# EAGLE design Multiplexer Breakout (EAGLE 9.2.2)
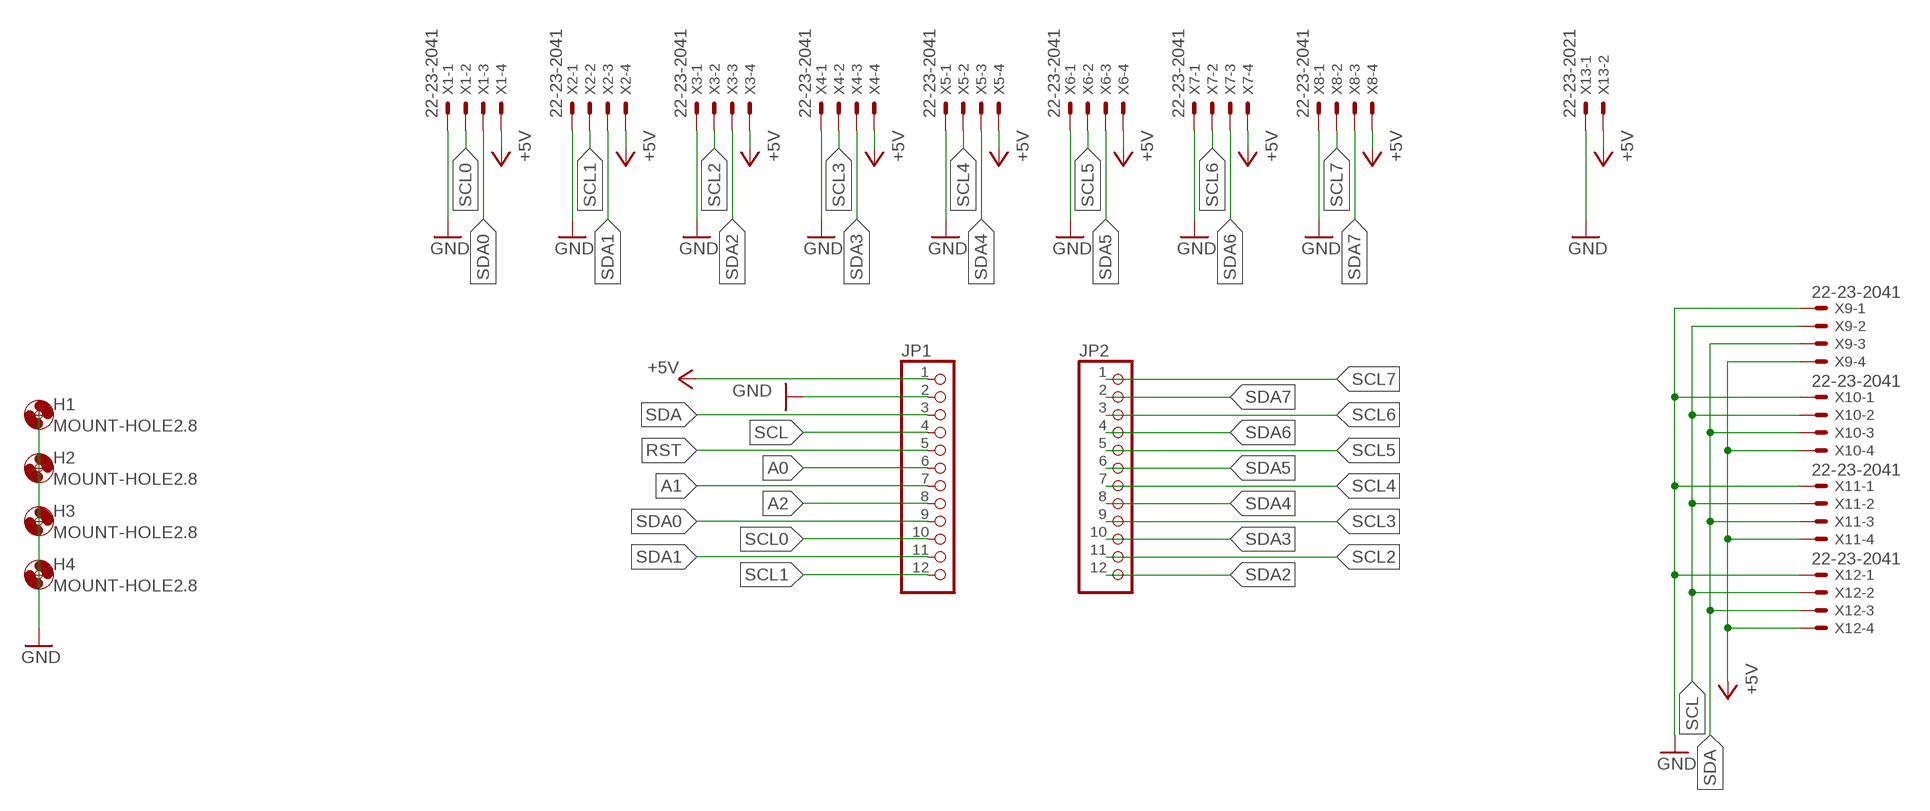
[diagram p0: schematic, sheet 1]

## Parts
H1  MOUNT-HOLE2.8  [2,8]
H2  MOUNT-HOLE2.8  [2,8]
H3  MOUNT-HOLE2.8  [2,8]
H4  MOUNT-HOLE2.8  [2,8]
JP1  PINHD-1X12  [1X12]
JP2  PINHD-1X12  [1X12]
X1  22-23-2041  [22-23-2041]
X2  22-23-2041  [22-23-2041]
X3  22-23-2041  [22-23-2041]
X4  22-23-2041  [22-23-2041]
X5  22-23-2041  [22-23-2041]
X6  22-23-2041  [22-23-2041]
X7  22-23-2041  [22-23-2041]
X8  22-23-2041  [22-23-2041]
X9  22-23-2041  [22-23-2041]
X10  22-23-2041  [22-23-2041]
X11  22-23-2041  [22-23-2041]
X12  22-23-2041  [22-23-2041]
X13  22-23-2021  [22-23-2021]

## Nets
+5V: JP1.1 X1.4 X2.4 X3.4 X4.4 X5.4 X6.4 X7.4 X8.4 X9.4 X10.4 X11.4 X12.4 X13.2
A0: JP1.6
A1: JP1.7
A2: JP1.8
GND: JP1.2 X1.1 X2.1 X3.1 X4.1 X5.1 X6.1 X7.1 X8.1 X9.1 X10.1 X11.1 X12.1 X13.1
RST: JP1.5
SCL: JP1.4 X9.2 X10.2 X11.2 X12.2
SCL0: JP1.10 X1.2
SCL1: JP1.12 X2.2
SCL2: JP2.11 X3.2
SCL3: JP2.9 X4.2
SCL4: JP2.7 X5.2
SCL5: JP2.5 X6.2
SCL6: JP2.3 X7.2
SCL7: JP2.1 X8.2
SDA: JP1.3 X9.3 X10.3 X11.3 X12.3
SDA0: JP1.9 X1.3
SDA1: JP1.11 X2.3
SDA2: JP2.12 X3.3
SDA3: JP2.10 X4.3
SDA4: JP2.8 X5.3
SDA5: JP2.6 X6.3
SDA6: JP2.4 X7.3
SDA7: JP2.2 X8.3

## Library data of the parts
H1-H4 = holes:MOUNT-HOLE: MOUNTING HOLE with drill center marker
JP1 JP2 = pinhead:PINHD-1X12: PIN HEADER
X1-X12 = con-molex:22-23-2041: .100" (2.54mm) Center Header - 4 Pin; MF: MOLEX; MPN: 22-23-2041; OC_FARNELL: 1462920; OC_NEWARK: 38C0355
X13 = con-molex:22-23-2021: .100" (2.54mm) Center Header - 2 Pin; MF: MOLEX; MPN: 22-23-2021; OC_FARNELL: 1462926; OC_NEWARK: 25C3832

## Board
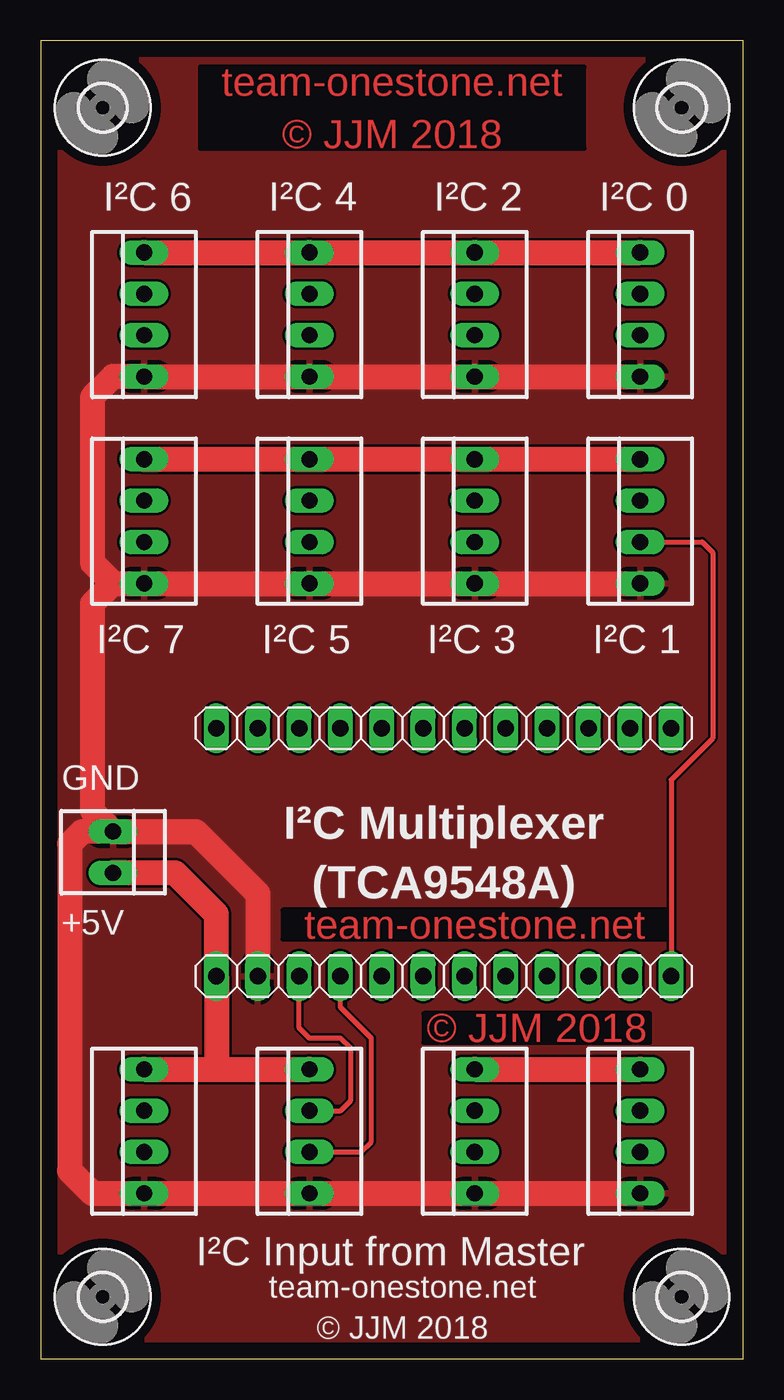
[diagram p1: board, top side]
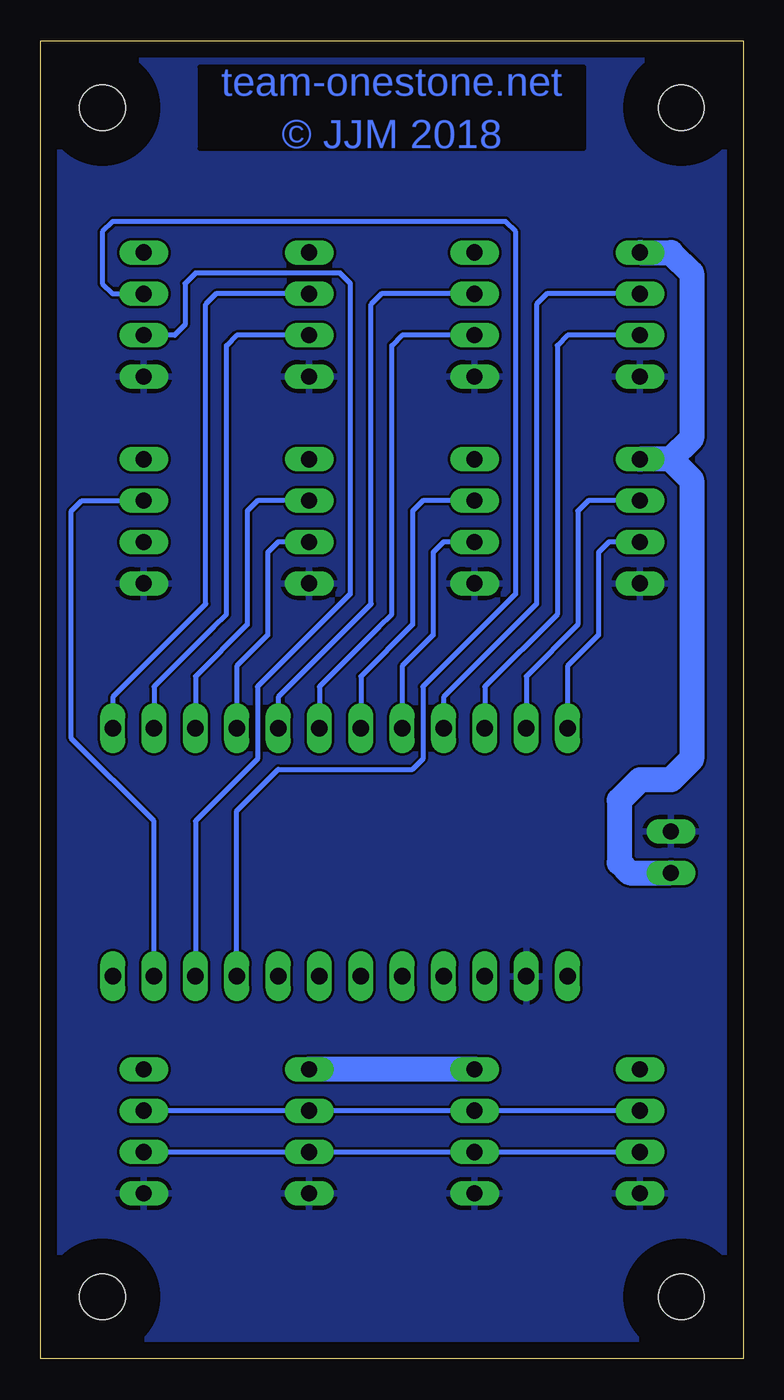
[diagram p2: board, bottom side, seen from below]

Size 43.16 x 80.95 mm. Coordinates in mm from the lower left corner, seen from the top.
Outline: 0,0 43.16,0 43.16,80.95 0,80.95 0,0
Copper layers (1*16): Top 0.035mm / dielectric 1.5mm / Bottom 0.035mm
Design rules "default": minimum track width 6mil, minimum drill 0.35mm, track to track 6mil, track to pad 6mil, pad to pad 6mil, via to via 6mil, smd to smd 6mil, copper to edge 40mil, drill to drill 6mil, minimum pad ring 10mil, minimum via ring 8mil, stop-mask expansion 4mil, vias tented up to drill 0mil, thermal gap 10mil

### Footprints (pad centres in the part's own frame; a part is rotated, then mirrored left to right if it is on the bottom)
2,8 = hole 2.8: 0,0
1X12 = drill 1.016 long: 1 -13.97,0; 2 -11.43,0; 3 -8.89,0; 4 -6.35,0; 5 -3.81,0; 6 -1.27,0; 7 1.27,0; 8 3.81,0; 9 6.35,0; 10 8.89,0; 11 11.43,0; 12 13.97,0
22-23-2041 = drill 1 long: 1 -3.81,0; 2 -1.27,0; 3 1.27,0; 4 3.81,0
22-23-2021 = drill 1 long: 1 -1.27,0; 2 1.27,0

### Placement (x,y rotation side)
H1  3.81,3.81 0 top
H2  39.37,3.81 0 top
H3  39.37,76.83 0 top
H4  3.81,76.83 0 top
JP1  24.77,23.5 0 top
JP2  24.77,38.73 0 top
X1  36.83,64.14 90 top
X2  36.83,51.44 90 top
X3  26.67,64.14 90 top
X4  26.67,51.44 90 top
X5  16.51,64.14 90 top
X6  16.51,51.44 90 top
X7  6.35,64.14 90 top
X8  6.35,51.44 90 top
X9  36.83,13.97 90 top
X10  26.67,13.97 90 top
X11  16.51,13.97 90 top
X12  6.35,13.97 90 top
X13  4.45,31.11 270 top

### Tracks (layer width: path | path; a pad name or v marks a point on that pad's centre or on a via)
+5V
  Top 1.524: X7.4 X5.4 X3.4 X1.4 | X8.4 X6.4 X4.4 X2.4 | X12.4 10.79,17.78 | 10.79,17.78 X11.4 | X10.4 X9.4 | X13.2 8.26,29.84 10.79,27.3 JP1.1 10.79,17.78
  Bottom 1.524: X7.4 4.45,67.94 3.17,66.67 3.17,56.52 4.45,55.24 | 4.45,55.24 X8.4 | 4.45,55.24 3.17,53.98 3.17,36.83 4.45,35.56 6.35,35.56 7.62,34.29 7.62,30.48 6.99,29.84 X13.2 | X11.4 X10.4
GND
  Top 1.524: X1.1 X3.1 X5.1 X7.1 4.45,60.33 3.17,59.05 3.17,48.9 4.45,47.62 | X2.1 X4.1 X6.1 X8.1 4.45,47.62 | 4.45,47.62 3.17,46.35 3.17,33.66 X13.1 | 17.14,10.16 X12.1 3.17,10.16 1.78,11.56 1.78,31.62 2.54,32.38 X13.1 | X11.1 X10.1 X9.1 | X13.1 9.53,32.38 13.34,28.57 JP1.2
  pour Top: 0,0 0,80.64 43.18,80.64 43.18,0
  pour Bottom: 0,0 0,80.64 43.18,80.64 43.18,0
SCL
  Top 0.305: X11.2 19.68,12.7 20.32,13.34 20.32,19.68 18.41,21.59 JP1.4
  Bottom 0.305: X9.2 X10.2 X11.2 X12.2
SCL0
  Bottom 0.305: X1.2 34.92,62.87 34.29,63.5 34.29,66.04 33.66,66.67 24.77,66.67 24.13,66.04 24.13,46.99 29.84,41.27 29.84,36.83 33.66,33.02 JP1.10
SCL1
  Top 0.305: X2.2 40.64,50.16 41.27,49.53 41.27,38.1 38.73,35.56 JP1.12
SCL2
  Bottom 0.305: X3.2 31.11,62.87 31.75,62.23 31.75,45.72 32.56,44.91 32.56,44.9 32.83,44.63 32.84,44.63 36.2,41.27 JP2.11
SCL3
  Bottom 0.305: X4.2 28.57,50.16 29.21,49.53 29.21,44.45 31.11,42.55 JP2.9
SCL4
  Bottom 0.305: X5.2 20.95,62.87 21.59,62.23 21.59,45.72 22.4,44.91 22.4,44.9 22.67,44.63 22.68,44.63 26.04,41.27 JP2.7
SCL5
  Bottom 0.305: X6.2 18.41,50.16 19.05,49.53 19.05,44.45 20.95,42.55 JP2.5
SCL6
  Bottom 0.305: X7.2 10.79,62.87 11.43,62.23 11.43,45.72 15.88,41.27 JP2.3
SCL7
  Bottom 0.305: X8.2 8.26,50.16 8.89,49.53 8.89,44.45 10.79,42.55 JP2.1
SDA
  Top 0.305: X11.3 18.41,15.24 19.05,15.88 19.05,19.05 18.41,19.68 16.51,19.68 15.88,20.32 JP1.3
  Bottom 0.305: X9.3 X10.3 X11.3 X12.3
SDA0
  Bottom 0.305: X1.3 38.73,65.41 39.37,66.04 39.37,69.22 38.73,69.85 14.61,69.85 13.97,69.22 13.97,46.99 19.68,41.27 19.68,36.83 20.32,36.2 28.57,36.2 31.11,33.66 JP1.9
SDA1
  Bottom 0.305: JP1.11 36.2,33.02 41.27,38.1 41.27,52.07 40.64,52.7 X2.3
SDA2
  Bottom 0.305: X3.3 32.38,65.41 33.02,64.77 33.02,46.35 38.73,40.64 JP2.12
SDA3
  Bottom 0.305: X4.3 29.84,52.7 30.48,52.07 30.48,45.09 33.66,41.91 JP2.10
SDA4
  Bottom 0.305: X5.3 22.23,65.41 22.86,64.77 22.86,46.35 28.57,40.64 JP2.8
SDA5
  Bottom 0.305: X6.3 19.68,52.7 20.32,52.07 20.32,45.09 23.5,41.91 JP2.6
SDA6
  Bottom 0.305: X7.3 12.06,65.41 12.7,64.77 12.7,46.35 18.41,40.64 JP2.4
SDA7
  Bottom 0.305: X8.3 9.53,52.7 10.16,52.07 10.16,45.09 13.34,41.91 JP2.2

### Text on the board
Top: team-onestone.net / © JJM 2018 | team-onestone.net | © JJM 2018
Bottom: team-onestone.net / © JJM 2018
tPlace: I²C 6 | I²C 4 | I²C 2 | I²C 0 | I²C 7 | I²C 5 | I²C 3 | I²C 1 | GND | I²C Multiplexer / (TCA9548A) | +5V | I²C Input from Master | team-onestone.net / © JJM 2018